# EAGLE design button_breakout (EAGLE 6.5.0)
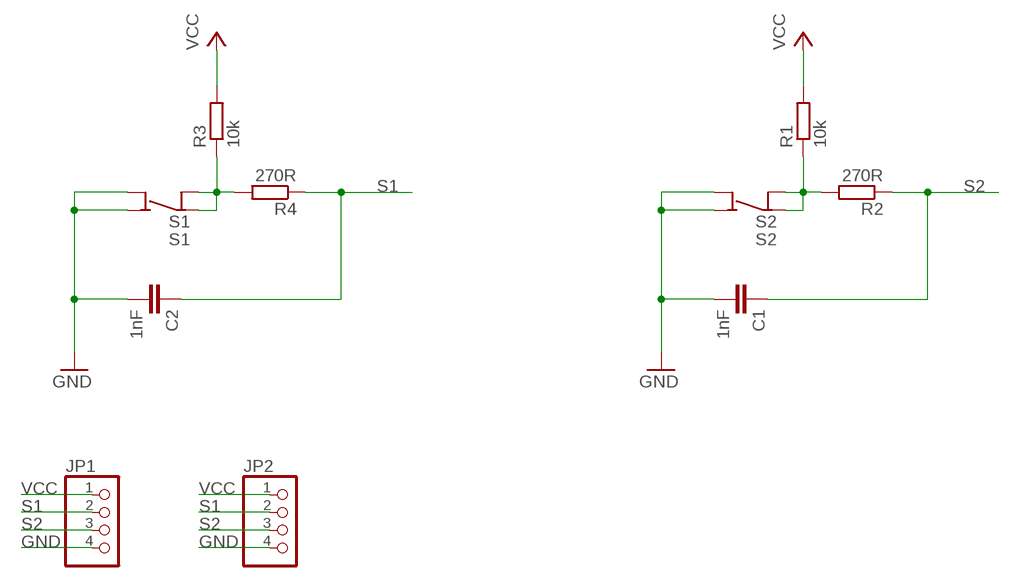
[diagram p0: schematic, sheet 1]

## Parts
C1  1nF  C-EUC0805  [C0805]
C2  1nF  C-EUC0805  [C0805]
JP1  PINHD-1X4  [1X04]
JP2  PINHD-1X4  [1X04]
R1  10k  R-EU_R0805  [R0805]
R2  270R  R-EU_R0805  [R0805]
R3  10k  R-EU_R0805  [R0805]
R4  270R  R-EU_R0805  [R0805]
S1  S1  SPST4  [6MMTACTILE_4PIN]
S2  S2  SPST4  [6MMTACTILE_4PIN]

## Nets
GND [GND]: C1.2 C2.2 JP1.4 JP2.4 S1.A1(NO) S1.A2(NO) S2.A1(NO) S2.A2(NO)
N$6: R3.1 R4.2 S1.B1(COM) S1.B2(COM)
N$8: R1.1 R2.2 S2.B1(COM) S2.B2(COM)
S1: C2.1 JP1.2 JP2.2 R4.1
S2: C1.1 JP1.3 JP2.3 R2.1
VCC [VCC]: JP1.1 JP2.1 R1.2 R3.2

## Library data of the parts
C1 C2 = resistor:C-EU: CAPACITOR, European symbol
JP1 JP2 = pinhead:PINHD-1X4: PIN HEADER
R1-R4 = resistor:R-EU_: RESISTOR, European symbol
S1 S2 = mes_electromech:SPST4: SPST switch with 2 pins per contact

## Net classes
0 default: width 0.305 mm, drill 0.508 mm
1 GND: width 0.61 mm, drill 0.508 mm
2 VCC: width 0.61 mm, drill 0.508 mm

## Board
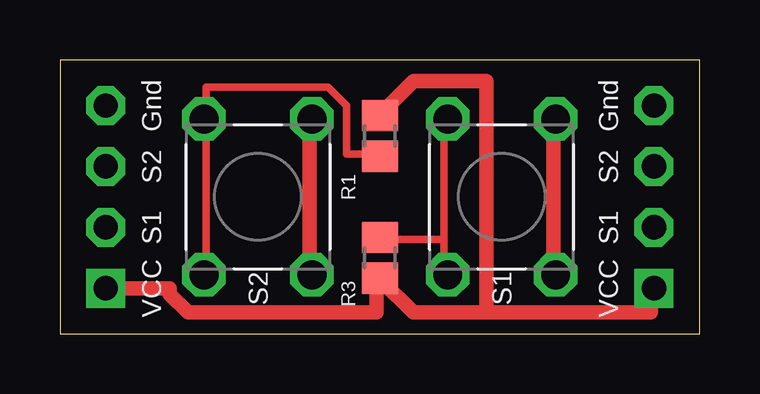
[diagram p1: board, top side]
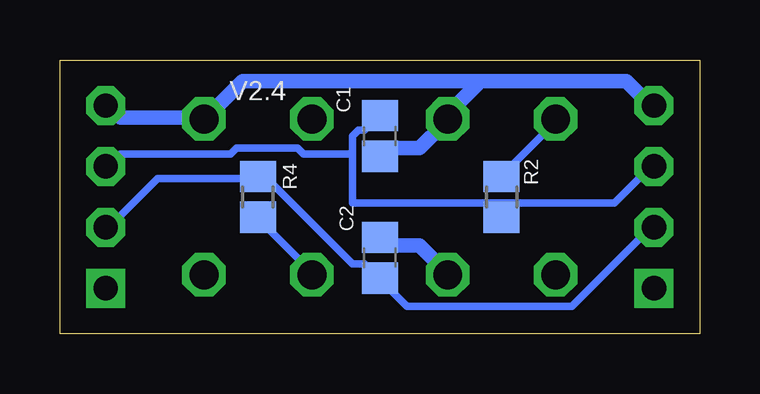
[diagram p2: board, bottom side, seen from below]

Size 26.67 x 11.43 mm. Coordinates in mm from the lower left corner, seen from the top.
Outline: 0,0 26.67,0 26.67,11.43 0,11.43 0,0
Copper layers (1*16): Top 0.035mm / dielectric 1.5mm / Bottom 0.035mm
Design rules "SparkFun *": minimum track width 12mil, minimum drill 20mil, track to track 8mil, track to pad 8mil, pad to pad 8mil, via to via 8mil, smd to smd 8mil, copper to edge 10mil, drill to drill 8mil, minimum pad ring 12mil, minimum via ring 10mil, stop-mask expansion 4mil, vias tented up to drill 25mil, thermal gap 10mil

### Footprints (pad centres in the part's own frame; a part is rotated, then mirrored left to right if it is on the bottom)
C0805 = smd 1.3 x 1.5: 1 -0.85,0; 2 0.85,0
1X04 = drill 1.016 square: 1 -3.81,0 | drill 1.016 octagon: 2 -1.27,0; 3 1.27,0; 4 3.81,0
R0805 = smd 1.3 x 1.5: 1 -0.85,0; 2 0.85,0
6MMTACTILE_4PIN = drill 1.2 octagon: A1 3.25,-2.25; A2 -3.25,-2.25; B1 3.25,2.25; B2 -3.25,2.25

### Placement (x,y rotation side)
C1  13.33,8.25 270 bottom
C2  13.33,3.17 90 bottom
JP1  1.9,5.71 90 top
JP2  24.76,5.71 90 top
R1  13.33,8.25 90 top
R2  8.25,5.71 90 bottom
R3  13.33,3.17 270 top
R4  18.42,5.71 270 bottom
S1  18.42,5.71 90 top
S2  8.25,5.71 90 top

### Tracks (layer width: path | path; a pad name or v marks a point on that pad's centre or on a via)
GND
  Top 0.61: S1.A2 20.57,2.67 20.57,8.76 S1.A1 | S2.A2 10.41,2.67 10.41,8.76 S2.A1
  Bottom 0.61: JP2.4 24.64,9.53 24.13,9.02 20.83,9.02 S1.A1 20.57,9.02 19.05,10.54 9.14,10.54 | C2.2 13.21,3.94 12.95,3.68 11.68,3.68 10.67,2.67 S2.A2 | C1.2 13.21,7.49 12.95,7.75 11.68,7.75 10.67,8.76 S2.A1 10.41,9.27 9.14,10.54 | 9.14,10.54 3.05,10.54 2.03,9.53 JP1.4
N$6
  Top 0.305: 16,3.94 13.46,3.94 R3.1 | 16,3.94 16,2.67 S1.B2 | 16,3.94 16,8.76 S1.B1
  Bottom 0.305: R4.2 18.29,4.7 16.26,2.67 S1.B2
N$8
  Top 0.305: R1.1 13.21,7.49 11.94,7.49 11.94,9.53 11.18,10.29 6.1,10.29 6.1,9.02 S2.B1 6.1,8.76 6.1,2.67 S2.B2
  Bottom 0.305: R2.2 8.13,6.73 6.1,8.76 S2.B1
S1
  Bottom 0.305: JP1.2 2.03,4.44 5.33,1.14 12.19,1.14 13.21,2.16 C2.1 13.46,2.41 13.97,2.92 14.48,2.92 18.03,6.48 18.29,6.48 R4.1 18.54,6.48 22.61,6.48 24.64,4.44 JP2.2
S2
  Bottom 0.305: 7.62,5.46 8.13,4.95 R2.1 7.62,5.46 | 7.62,5.46 3.56,5.46 2.03,6.99 JP1.3 | 14.48,7.49 14.48,5.46 7.62,5.46 | 14.48,7.49 14.48,8.25 14.22,8.51 13.97,8.51 13.46,9.02 C1.1 | 14.48,7.49 16.51,7.49 16.76,7.75 19.3,7.75 19.56,7.49 24.13,7.49 24.64,6.99 JP2.3
VCC
  Top 0.61: 17.78,0.89 24.64,0.89 24.64,1.91 JP2.1 | 17.78,0.89 14.73,0.89 13.46,2.16 R3.2 13.21,2.16 13.21,0.89 5.33,0.89 4.57,1.65 4.57,1.91 JP1.1 | 17.78,0.89 17.78,10.54 14.73,10.54 13.46,9.27 R1.2

### Text on the board
tNames: Gnd | Gnd | S2 | S2 | S1 | S1 | VCC | VCC
bNames: V2.4